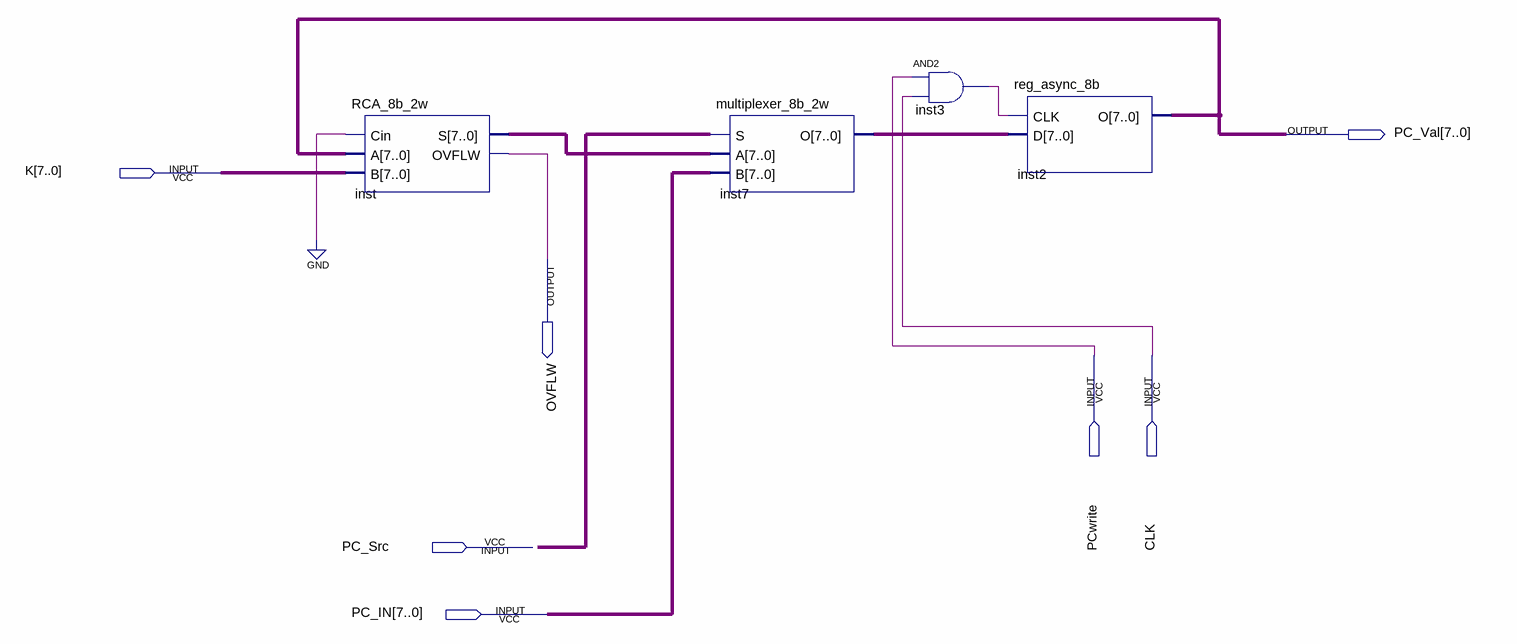
[diagram p0: schematic sheet]
// Quartus schematic PC.bdf as structural Verilog: 4 symbols, 7 pins
module PC (
  input  [7:0] K,
  input  PCwrite,
  input  CLK,
  input  PC_Src,
  input  [7:0] PC_IN,
  output [7:0] PC_Val,
  output OVFLW
);

  wire inst3_out;
  wire [7:0] inst7_o, inst_s;

  RCA_8b_2w inst (.Cin(1'b0), .A(PC_Val), .B(K), .S(inst_s), .OVFLW(OVFLW));
  multiplexer_8b_2w inst7 (.S(PC_Src), .A(inst_s), .B(PC_IN), .O(inst7_o));
  and inst3 (inst3_out, PCwrite, CLK);
  reg_async_8b inst2 (.CLK(inst3_out), .D(inst7_o), .O(PC_Val));
endmodule
